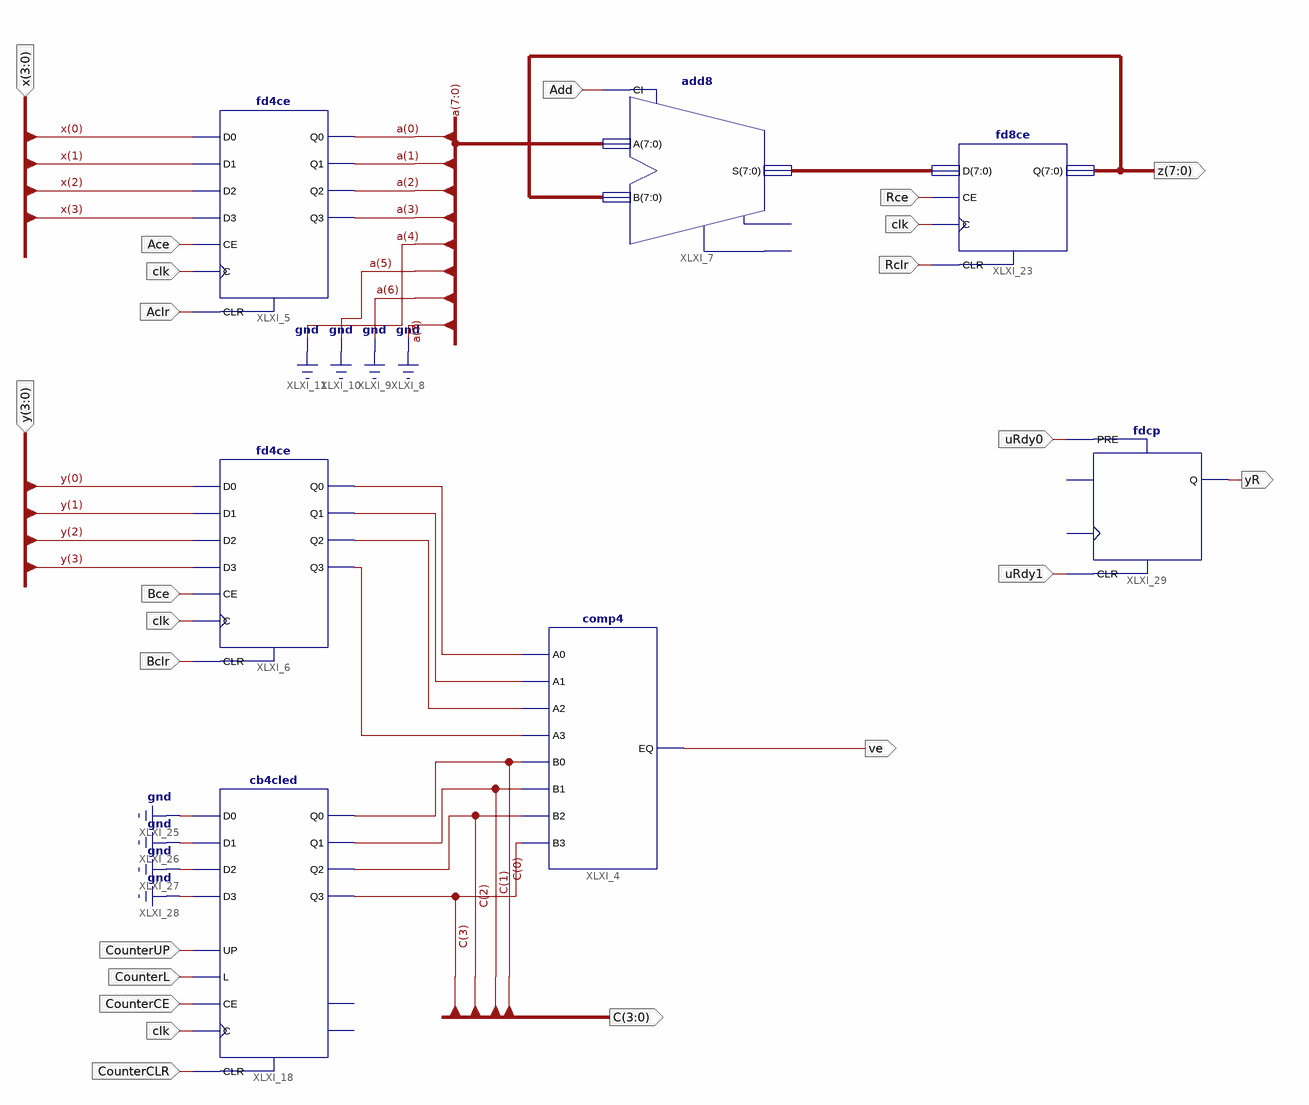
[diagram p0: schematic sheet 1]
// Xilinx ISE schematic PartA.sch (spartan3a) as structural Verilog: 7 symbols, 20 ports
module PartA (
  input  [3:0] x,
  input  Ace,
  input  clk,
  input  Aclr,
  input  Add,
  input  [3:0] y,
  input  CounterCLR,
  input  Rclr,
  input  CounterUP,
  input  CounterL,
  input  CounterCE,
  input  Bclr,
  input  Bce,
  input  Rce,
  input  uRdy1,
  input  uRdy0,
  output [7:0] z,
  output ve,
  output yR,
  output [3:0] C
);

  wire XLXN_35, XLXN_36, XLXN_37, XLXN_38;
  wire [3:0] a;
  wire [7:0] XLXN_49;

  comp4 XLXI_4 (
    .A0(XLXN_35), .A1(XLXN_36), .A2(XLXN_37), .A3(XLXN_38), .B0(C[0]), .B1(C[1]), .B2(C[2]), .B3(C[3]),
    .EQ(ve));
  fd4ce XLXI_5 (
    .C(clk), .CE(Ace), .CLR(Aclr), .D0(x[0]), .D1(x[1]), .D2(x[2]), .D3(x[3]), .Q0(a[0]), .Q1(a[1]),
    .Q2(a[2]), .Q3(a[3]));
  fd4ce XLXI_6 (
    .C(clk), .CE(Bce), .CLR(Bclr), .D0(y[0]), .D1(y[1]), .D2(y[2]), .D3(y[3]), .Q0(XLXN_35), .Q1(XLXN_36),
    .Q2(XLXN_37), .Q3(XLXN_38));
  add8 XLXI_7 (.A({4'b0000, a}), .B(z), .CI(Add), .S(XLXN_49));  // open: CO, OFL
  cb4cled XLXI_18 (
    .C(clk), .CE(CounterCE), .CLR(CounterCLR), .D0(1'b0), .D1(1'b0), .D2(1'b0), .D3(1'b0), .L(CounterL),
    .UP(CounterUP), .Q0(C[0]), .Q1(C[1]), .Q2(C[2]), .Q3(C[3]));  // open: CEO, TC
  fd8ce XLXI_23 (.C(clk), .CE(Rce), .CLR(Rclr), .D(XLXN_49), .Q(z));
  fdcp XLXI_29 (.CLR(uRdy1), .PRE(uRdy0), .Q(yR));  // open: C, D
endmodule
